# EasyEDA Pro project Magmattic PCB_V2.eprj, board AmpAdc
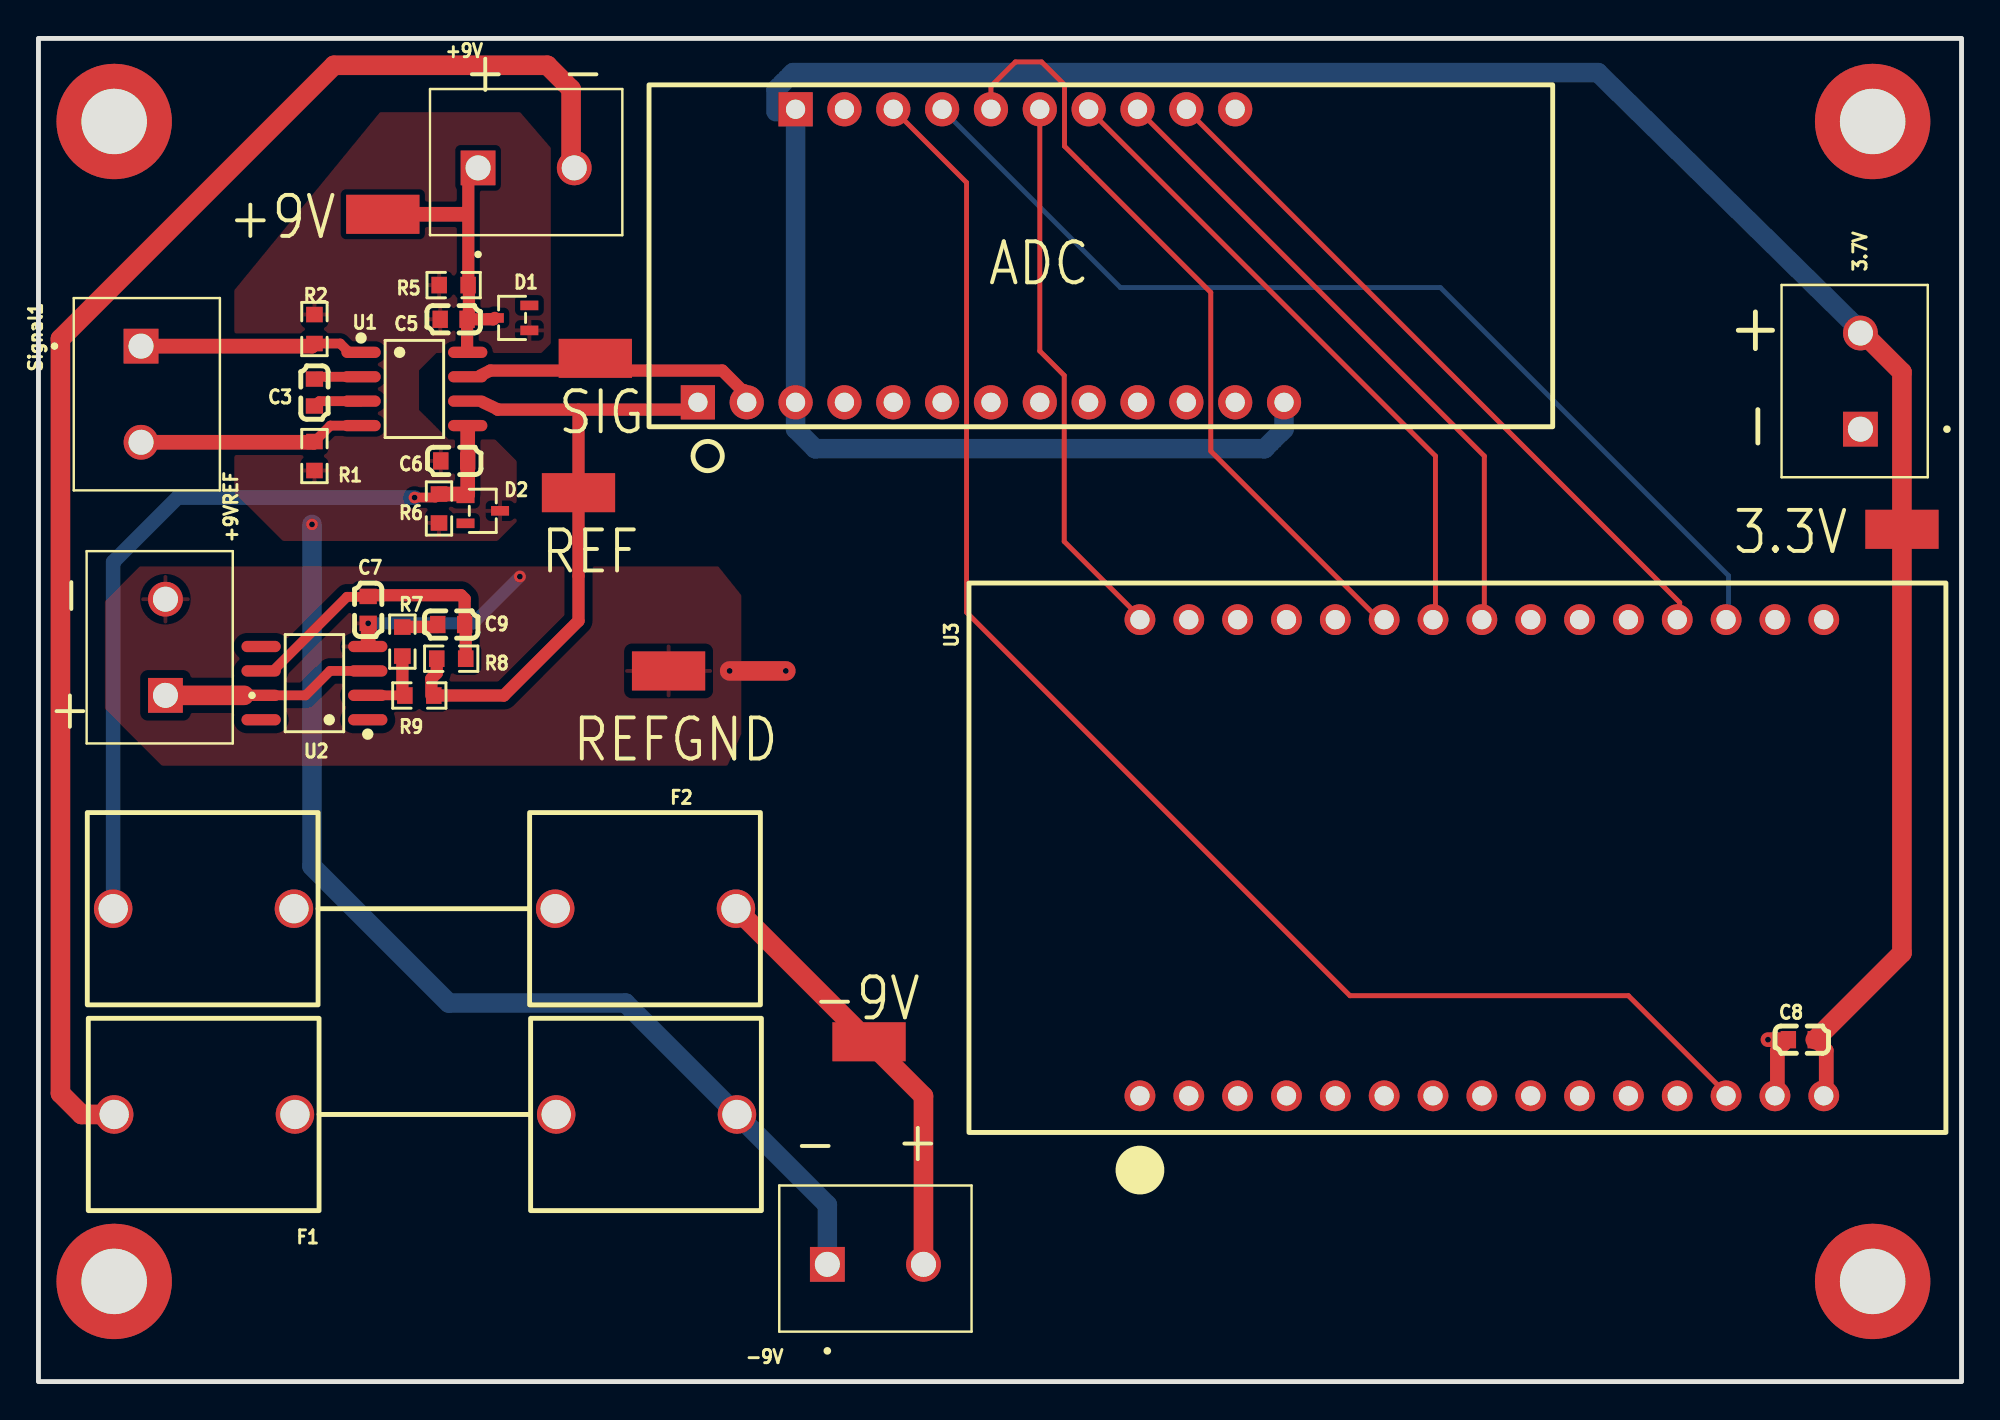
[diagram p6: board, top side]
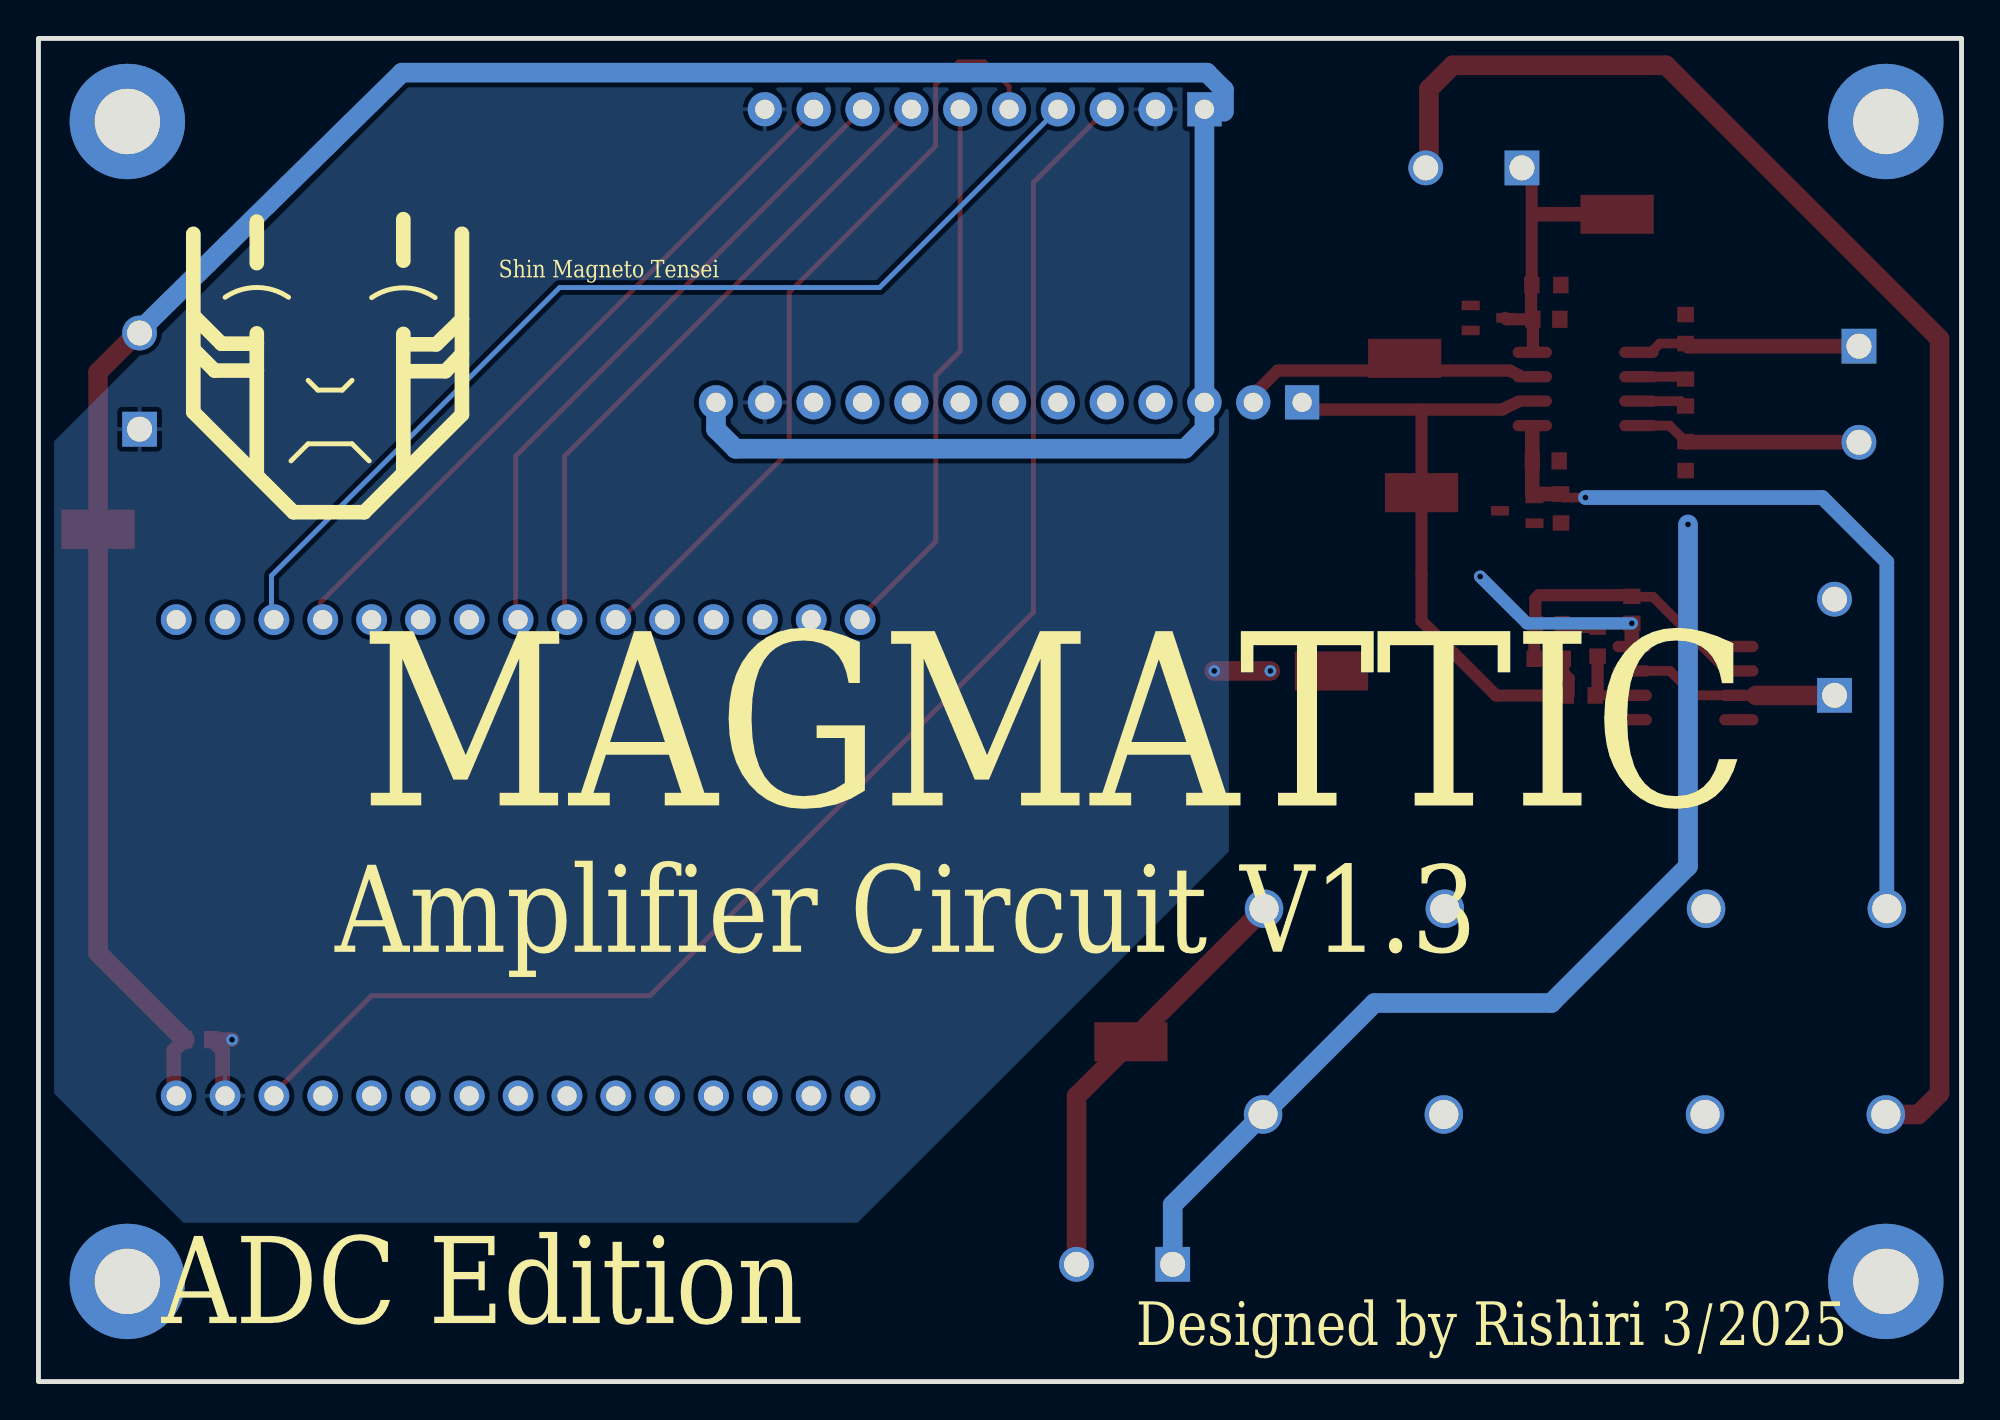
[diagram p7: board, bottom side, seen from below]

Outline 100 x 69.85 mm; copper layers: Top Layer, Bottom Layer. Coordinates in mm from the lower left corner of the outline.
Outline path: rectangle 0,69.85 100,0
Stack: Top Layer 0.035mm / Dielectric1 1.51mm FR4 er 4.5 / Bottom Layer 0.035mm

## Design rules (mm)
template: Custom Config
spacing copperThickness1oz (default): track to track 0.152, other pairs 0.152 to 0.3
spacing copperThickness2oz: track to track 0.203, other pairs 0.152 to 0.3
track width copperThickness1oz (default): min 0.127, default 0.254, max 2.54
track width copperThickness2oz: min 0.203, default 0.254, max 2.54
differential pair differentialPair (default): width min 0.127, default 0.254, max 2.54; gap min 0.152, default 0.152
via viaSize (default): diameter min 0.5, default 0.61, max 10; hole min 0.3, default 0.305, max 6.3

## Placement (name value [footprint] x y rotation side)
3.7V  Output  [CUI_TB002-500-02BE]  94.74 49.53 90 top
+9V  Output  [CUI_TB002-500-02BE]  22.86 63.12 0 top
+9VREF  Output  [CUI_TB002-500-02BE]  6.6 35.69 90 top
-9V  Output  [CUI_TB002-500-02BE]  41.02 6.1 0 top
C3  47nF  [C0603]  14.35 51.44 90 top
C5  .1u  [C0603]  21.59 55.25 0 top
C6  .1u  [C0603]  21.62 47.88 0 top
C7  10u  [C0603]  17.14 40.13 270 top
C8  .1u  [C0603]  91.69 17.78 180 top
C9  39nF  [C0603]  21.46 39.37 180 top
CON1  CON14  [OLIMEX_Connectors-FP:HN1x13]  50.8 50.93 0 top
CON2  CON10  [OLIMEX_Connectors-FP:HN1x10]  50.8 66.17 0 top
D1  BZX84W-C27F  [SOT-323-3_L2.0-W1.3-P1.30-LS2.1-BR]  24.63 55.32 0 top
D2  BZX84W-C27F  [SOT-323-3_L2.0-W1.3-P1.30-LS2.1-BR]  23.1 45.28 180 top
F1  -  [10mA Fuse]  37.59 8.89 180 top
F2  -  [10mA Fuse]  37.54 19.59 180 top
NOREF  -  [Pad_e944]  96.9 44.32 180 top
NOREF#2  -  [Pad_e86]  3.94 5.21 0 top
NOREF#3  -  [Pad_e88]  95.38 65.53 0 top
NOREF#4  -  [Pad_e87]  95.38 5.21 0 top
NOREF#5  -  [Pad_e915]  43.19 17.67 180 top
NOREF#6  -  [Pad_e916]  28.96 53.21 180 top
NOREF#7  -  [Pad_e886]  17.91 60.71 180 top
NOREF#8  -  [Pad_e917]  28.08 46.23 180 top
NOREF#9  -  [Pad_e4]  32.77 36.96 180 top
NOREF#10  -  [Pad_e80]  3.94 65.53 0 top
R1  100k  [R0603]  14.35 48.13 90 top
R2  100k  [R0603]  14.35 54.74 90 top
R5  3300  [R0603]  21.59 57.02 0 top
R6  3300  [R0603]  20.83 45.41 90 top
R7  10k  [R0603]  18.92 38.48 270 top
R8  37.4  [R0603]  21.46 37.59 0 top
R9  1k  [R0603]  19.8 35.68 180 top
Signal1  Signal  [CUI_TB002-500-02BE]  5.33 53.85 270 top
U1  INA848IDR  [SOIC-8_L4.9-W3.9-P1.27-LS6.0-BL]  19.55 51.62 270 top
U2  OPA197IDR  [SOIC-8_L4.9-W3.9-P1.27-LS6.0-BL]  14.35 36.32 90 top
U3  X5621WV-2x15-C1524D1220  [ESP32]  75.06 39.62 0 top

## Footprints (pads in the part's own frame, mm; a bottom-side part is the same pattern mirrored in y, then rotated)
10mA Fuse
  round 2 hole 1.52: 1(1.27,-5) 2(10.67,-5) 3(24.255,-5) 4(33.655,-5)
C0603
  rect 0.8x0.9 smd: 1(-0.7,0) 2(0.7,0)
CUI_TB002-500-02BE
  rect 1.808x1.808 hole 1.3: 1(0,0)
  round 1.808 hole 1.3: 2(5,0)
ESP32
  round 1.6 hole 1: 1(-17.78,-24.765) 2(-15.24,-24.765) 3(-12.7,-24.765) 4(-10.16,-24.765) 5(-7.62,-24.765) 6(-5.08,-24.765) 7(-2.54,-24.765) 8(0,-24.765) 9(2.54,-24.765) 10(5.08,-24.765) 11(7.62,-24.765) 12(10.16,-24.765) 13(12.7,-24.765) 14(15.24,-24.765) 15(17.78,-24.765) 16(17.78,0) 17(15.24,0) 18(12.7,0) 19(10.16,0) 20(7.62,0) 21(5.08,0) 22(2.54,0) 23(0,0) 24(-2.54,0) 25(-5.08,0) 26(-7.62,0) 27(-10.16,0) 28(-12.7,0) 29(-15.24,0) 30(-17.78,0)
OLIMEX_Connectors-FP:HN1x10
  rect 1.778x1.778 hole 1: 1(-11.43,0)
  round 1.778 hole 1: 2(-8.89,0) 3(-6.35,0) 4(-3.81,0) 5(-1.27,0) 6(1.27,0) 7(3.81,0) 8(6.35,0) 9(8.89,0) 10(11.43,0)
OLIMEX_Connectors-FP:HN1x13
  rect 1.778x1.778 hole 1: 1(-16.51,0)
  round 1.778 hole 1: 2(-13.97,0) 3(-11.43,0) 4(-8.89,0) 5(-6.35,0) 6(-3.81,0) 7(-1.27,0) 8(1.27,0) 9(3.81,0) 10(6.35,0) 11(8.89,0) 12(11.43,0) 13(13.97,0)
Pad_e4
  rect 3.81x2.032 smd: TP1(0,0)
Pad_e80
  round 6 hole 3.4: 1(0,0)
Pad_e86
  round 6 hole 3.4: 1(0,0)
Pad_e87
  round 6 hole 3.4: 1(0,0)
Pad_e88
  round 6 hole 3.4: 1(0,0)
Pad_e886
  rect 3.81x2.032 smd: TP1(0,0)
Pad_e915
  rect 3.81x2.032 smd: TP1(0,0)
Pad_e916
  rect 3.81x2.032 smd: TP1(0,0)
Pad_e917
  rect 3.81x2.032 smd: TP1(0,0)
Pad_e944
  rect 3.81x2.032 smd: TP1(0,0)
R0603
  rect 0.806x0.864 smd: 1(-0.753,0) 2(0.753,0)
SOIC-8_L4.9-W3.9-P1.27-LS6.0-BL
  oval 0.588x2.045 smd: 1(-1.905,-2.772) 2(-0.635,-2.772) 3(0.635,-2.772) 4(1.905,-2.772) 5(1.905,2.772) 6(0.635,2.772) 7(-0.635,2.772) 8(-1.905,2.772)
SOT-323-3_L2.0-W1.3-P1.30-LS2.1-BR
  rect 0.936x0.5 smd: 1(0.898,-0.65) 2(0.898,0.65) 3(-0.898,0)

## Nets
As in the schematic, except:
3.3V: 3.7V.2 C8.1 CON1.3 CON1.13 CON2.1 NOREF.TP1 U3.15
9V: +9V.1 C5.2 D1.3 NOREF#7.TP1 R5.2 U1.8
AIN0: CON1.1 NOREF#8.TP1 R8.1 R9.1 U1.6
AIN1: CON1.2 NOREF#6.TP1 U1.7
BB-ADS1262-REV.A_GNDD: 3.7V.1 +9VREF.2 C7.2 C8.2 CON1.12 CON2.2 CON2.10 NOREF#9.TP1 U2.4 U3.14
$1N6194: -9V.2 F2.1 NOREF#5.TP1

Pads without a net: D1 2; D2 2; F1 2 3; F2 2 3; NOREF#2 1; NOREF#3 1; NOREF#4 1; NOREF#10 1; U2 1 5 8

## Via types
v1: diameter 0.61, hole 0.305, Top Layer to Bottom Layer, 7 vias

## Routing (per net, layer and track width the routed paths; a pad name or vN(x,y) marks a point on that pad's centre or on a via; arc(x,y) is an arc through that point)
AMPGND: length 55
  Bottom Layer w1.016: v1(14.22,44.58) 14.22,26.8 21.34,19.69 30.53,19.69 F1.1 41.02,9.19 -9V.1
BB-ADS1262-REV.A_GNDD: length 16.9
  Top Layer w0.762: v1(17.14,39.43) 17.14,38.52 ; v1(89.93,17.78) C8.2 90.42,17.21 90.42,14.86
  Top Layer w1.016: v1(35.94,36.96) v1(38.86,36.96)
  Bottom Layer w0.635: v1(17.14,39.43) 22.6,39.43 v1(25.03,41.86)
IN+: length 11.8
  Top Layer w0.508: R1.2 15.18,49.72 U1.4
  Top Layer w0.762: Signal1.2 14.31,48.85 R1.2
$1N826: length 2.5
  Top Layer w0.508: C3.2 14.47,52.26 U1.2
$1N829: length 2.5
  Top Layer w0.508: U1.3 14.6,50.99 C3.1
$1N6250: length 41.2
  Top Layer w0.508: v1(19.56,45.97) 20.64,45.97 R6.2
  Top Layer w0.762: R6.2 22.32,46.16 22.32,46.16 22.32,49.46
  Bottom Layer w0.762: F2.4 3.88,42.62 7.24,45.97 v1(19.56,45.97)
3.3V: length 150.5
  Top Layer w0.762: C8.1 92.96,17.21 92.96,14.86
  Top Layer w1.016: C8.1 96.9,22.29 96.9,52.5 94.87,54.53
  Bottom Layer w1.016: 38.35,66.04 38.35,67.18 39.24,68.07 81.1,68.07 94.87,54.53 ; CON2.1 CON1.3 39.37,49.53 40.39,48.51 63.75,48.51 64.77,49.53 CON1.13
9VREF: length 10.2
  Top Layer w0.508: U2.7 13.89,35.69 15.16,36.96 17.12,36.96
  Top Layer w1.016: 10.7,35.69 +9VREF.1
AIN0: length 33.1
  Top Layer w0.635: 20.43,35.68 20.43,36.56 20.71,36.84 R8.1 ; 20.6,35.68 24.2,35.68 28.08,39.56 28.08,50.55 ; 23.11,50.93 23.88,50.57 23.88,50.55 34.04,50.55
AIN1: length 14.2
  Top Layer w0.635: 22.99,52.32 23.49,52.58 35.56,52.58 36.58,51.56 36.7,51.56
CS#: length 34
  Top Layer w0.254: CON2.8 75.18,48.13 75.18,39.62
D2: length 37.2
  Top Layer w0.254: CON2.9 85.34,40.51 85.34,39.62
D13: length 77.8
  Top Layer w0.254: CON2.3 48.26,62.36 48.26,40.01 68.2,20.07 82.68,20.07 87.88,14.86
D15: length 53.2
  Bottom Layer w0.254: CON2.4 56.26,56.9 72.9,56.9 87.88,41.91 87.88,39.62
D18: length 34
  Top Layer w0.254: CON2.7 72.64,48.13 72.64,39.62
D19: length 41.3
  Top Layer w0.254: 49.53,65.88 49.53,67.36 50.8,68.63 52.16,68.63 53.35,67.44 53.35,64.25 60.96,56.64 60.96,48.39 69.72,39.62 70.1,39.62
D23: length 28.8
  Top Layer w0.254: CON2.6 52.07,53.59 53.34,52.32 53.34,43.69 57.4,39.62
IN-: length 11.1
  Top Layer w0.508: R2.1 15.69,53.98 16.15,53.53
  Top Layer w0.762: Signal1.1 14.22,53.85 R2.1
$1N833: length 79.6
  Top Layer w1.016: F1.4 2.24,13.89 1.14,14.99 1.14,54.23 15.37,68.45 26.46,68.45 27.7,67.22 27.7,63.28 +9V.2
$1N6194: length 22.5
  Top Layer w1.016: F2.1 46.02,14.84 -9V.2
$1N6970: length 3.9
  Top Layer w0.508: 17,35.69 18.91,35.69 18.92,35.68
  Top Layer w0.635: 18.92,35.68 18.92,37.69
$1N6974: length 14.6
  Top Layer w0.508: 12.19,36.96 16.05,40.81 16.86,40.81
  Top Layer w0.635: 17.02,40.83 17.08,40.89 21.97,40.89 22.16,40.7 C9.1 22.22,39.32 R8.2
$1N7595: length 1.7
  Top Layer w0.635: 20.76,39.24 19.06,39.24

## Copper pours and planes (outline as drawn; the poured copper is in the pictures)
AMPGND on Top Layer: 20.7,53.47 19.81,52.58 19.81,50.55 21.34,49.02 23.75,49.02 24.89,47.88 24.89,44.7 23.88,43.69 12.7,43.69 10.16,46.23 10.16,56.77 17.74,66.04 25.06,66.04 26.67,64.17 26.67,53.98 26.16,53.47
BB-ADS1262-REV.A_GNDD on Top Layer: 36.7,40.95 36.7,33.66 35.93,31.88 6.35,31.88 3.3,34.93 3.3,40.64 5.21,42.55 35.42,42.55
BB-ADS1262-REV.A_GNDD on Bottom Layer: 99.19,48.9 79.63,68.45 39.37,68.45 38.1,67.18 38.1,27.56 57.4,8.26 92.46,8.26 99.19,14.99

## Text on the board
Bottom Silkscreen Layer: Shin Magneto Tensei | Designed by Rishiri 3/2025 | Amplifier Circuit V1.3 | ADC Edition | MAGMATTIC
Top Silkscreen Layer: + | +9V | REF | SIG | - | REFGND | -9V | ADC | 3.3V
